# EAGLE schematic OLM-base_v0.2 (EAGLE 6.4)
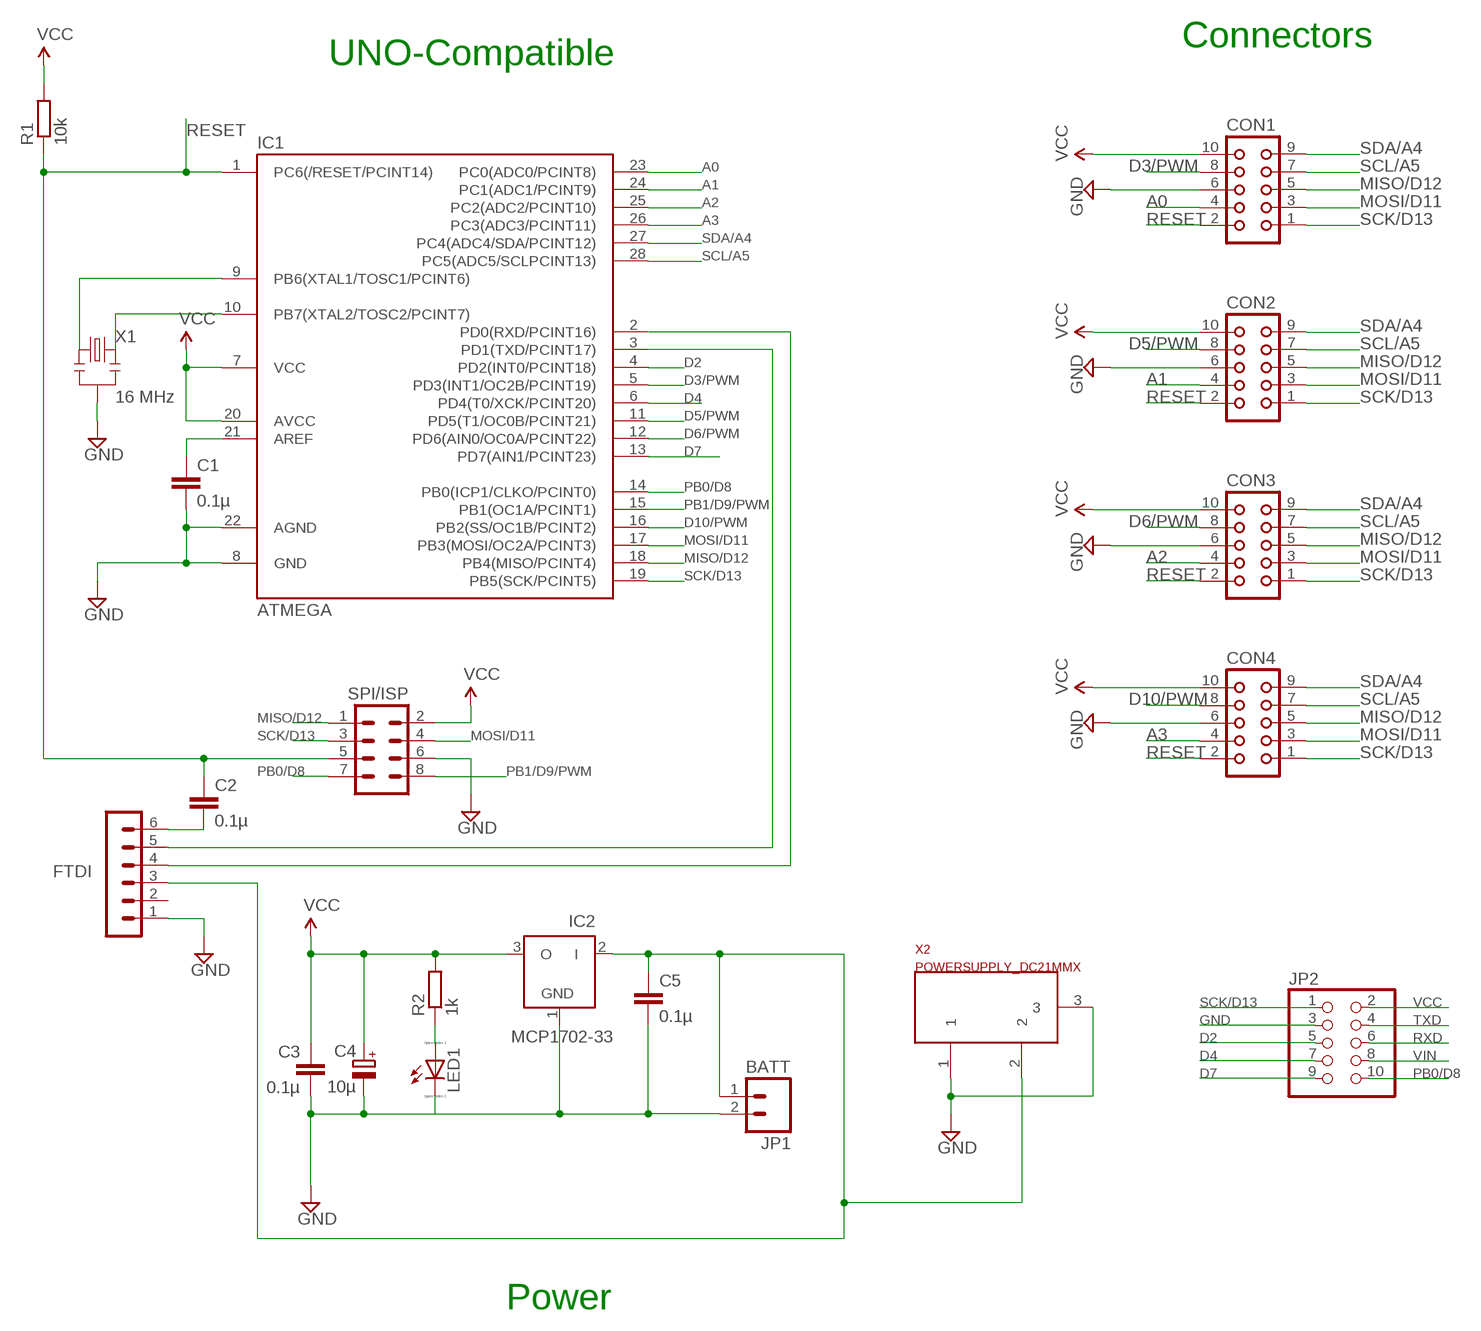
[diagram p0: schematic, sheet 1]

## Parts
C1  0.1µ  C-EU025-024X044  [C025-024X044]
C2  0.1µ  C-EU025-024X044  [C025-024X044]
C3  0.1µ  C-EU025-024X044  [C025-024X044]
C4  10µ  CPOL-EUE1.8-4  [E1,8-4]
C5  0.1µ  C-EU025-024X044  [C025-024X044]
CON1  CON10L  [CON10L]
CON2  CON10L  [CON10L]
CON3  CON10L  [CON10L]
CON4  CON10L  [CON10L]
FTDI  FTDI  MA06-1  [MA06-1]
IC1  ATMEGA  ATMEGA48/88/168-PU  [DIL28-3]
IC2  MCP1702-33  MCP1702Z  [TO92]
JP1  BATT  M02LOCK_LONGPADS  [1X02_LOCK_LONGPADS]
JP2  PINHD-2X5  [2X05]
LED1  LED_ELD260  [LED_LD260]
R1  10k  R-EU_0204/7  [0204/7]
R2  1k  R-EU_0204/7  [0204/7]
SV1  SPI/ISP  MA04-2  [MA04-2]
X1  16 MHz  RESONATORPTH  [RESONATOR-PTH]
X2  POWERSUPPLY_DC21MMX  [POWERSUPPLY_DC-21MM]

## Nets
A0: CON1.4 IC1.23(PC0(ADC0/PCINT8))
A1: CON2.4 IC1.24(PC1(ADC1/PCINT9))
A2: CON3.4 IC1.25(PC2(ADC2/PCINT10))
A3: CON4.4 IC1.26(PC3(ADC3/PCINT11))
D2: IC1.4(PD2(INT0/PCINT18)) JP2.5
D3/PWM: CON1.8 IC1.5(PD3(INT1/OC2B/PCINT19))
D4: IC1.6(PD4(T0/XCK/PCINT20)) JP2.7
D5/PWM: CON2.8 IC1.11(PD5(T1/OC0B/PCINT21))
D6/PWM: CON3.8 IC1.12(PD6(AIN0/OC0A/PCINT22))
D7: IC1.13(PD7(AIN1/PCINT23)) JP2.9
D10/PWM: CON4.8 IC1.16(PB2(SS/OC1B/PCINT2))
GND [power]: C1.2 C3.2 C4.- C5.2 CON1.6 CON2.6 CON3.6 CON4.6 FTDI.1 IC1.8(GND) IC1.22(AGND) IC2.1(GND) JP1.2 JP2.3 SV1.6 X1.2 X2.1 X2.3
MISO/D12: CON1.5 CON2.5 CON3.5 CON4.5 IC1.18(PB4(MISO/PCINT4)) SV1.1
MOSI/D11: CON1.3 CON2.3 CON3.3 CON4.3 IC1.17(PB3(MOSI/OC2A/PCINT3)) SV1.4
N$1: IC1.9(PB6(XTAL1/TOSC1/PCINT6)) X1.1
N$2: LED1.K(C)
N$4: FTDI.5 IC1.3(PD1(TXD/PCINT17))
N$7: FTDI.4 IC1.2(PD0(RXD/PCINT16))
N$14: LED1.A R2.1
N$16 [power]: C5.1 FTDI.3 IC2.2(I) JP1.1 X2.2
N$19: C1.1 IC1.21(AREF)
N$20: C2.2 FTDI.6
N$21: IC1.10(PB7(XTAL2/TOSC2/PCINT7)) X1.3
PB0/D8: IC1.14(PB0(ICP1/CLKO/PCINT0)) JP2.10 SV1.7
PB1/D9/PWM: IC1.15(PB1(OC1A/PCINT1)) SV1.8
RESET: C2.1 CON1.2 CON2.2 CON3.2 CON4.2 IC1.1(PC6(/RESET/PCINT14)) R1.1 SV1.5
RXD: JP2.6
SCK/D13: CON1.1 CON2.1 CON3.1 CON4.1 IC1.19(PB5(SCK/PCINT5)) JP2.1 SV1.3
SCL/A5: CON1.7 CON2.7 CON3.7 CON4.7 IC1.28(PC5(ADC5/SCLPCINT13))
SDA/A4: CON1.9 CON2.9 CON3.9 CON4.9 IC1.27(PC4(ADC4/SDA/PCINT12))
TXD: JP2.4
VCC [power]: C3.1 C4.+ CON1.10 CON2.10 CON3.10 CON4.10 IC1.7(VCC) IC1.20(AVCC) IC2.3(O) JP2.2 R1.2 R2.2 SV1.2
VIN: JP2.8
Unconnected: FTDI.2

## Notes on the sheet
- Connectors
- UNO-Compatible
- Power

## Library data of the parts
C1-C3 C5 = resistor:C-EU: CAPACITOR, European symbol
C4 = resistor:CPOL-EU: POLARIZED CAPACITOR, European symbol
CON1-CON4 = con-harting:CON10L: CONNECTOR; OC_FARNELL: unknown; OC_NEWARK: unknown
FTDI = JeeLabs:MA06-1: PIN HEADER
IC1 = atmega8:ATMEGA48/88/168-PU
IC2 = JeeLabs:MCP1702: 200 mA, Low Power Low Dropout Voltage Regulator
JP1 = SparkFun:M02: Header 2 Standard 2-pin 0.1" header. Use with straight break away headers (SKU : PRT-00116), right angle break away headers (PRT-00553), swiss pins (PRT-00743), machine pins (PRT-00117), and female headers (PRT-00115). Molex polarized connector foot print use with SKU : PRT-08233 with associated crimp pins and housings.
JP2 = pinhead:PINHD-2X5: PIN HEADER
LED1 = eagle-ltspice:LED_E: LED Source: http://www.osram.convergy.de Source: www.luxeon.com Source: www.kingbright.com; SPICEMODEL: NONE; SPICEPREFIX: D; SPICETYPE: diode
R1 R2 = resistor:R-EU_: RESISTOR, European symbol
SV1 = JeeLabs:MA04-2: PIN HEADER
X1 = SparkFun:RESONATOR: Resonator Small SMD resonator. This is the itty bitty 10/20MHz resonators with built in caps. CSTCE10M0G55 and CSTCE20M0V53. Footprint has been reviewed closely but hasn't been tested yet.
X2 = SmartPrj:POWERSUPPLY_DC21MM

## Net classes
1 power: width 0.813 mm, clearance 0.203 mm
2 gnd: width 0.305 mm, drill 0.559 mm, clearance 0.254 mm